# Altium project Mustafa_oguz_pcb.PrjPcb (part 3 of 3)

## Sheet Sensor Board.SchDoc
size 381 x 241 mm; SheetNumber: 5; SheetTotal: 5
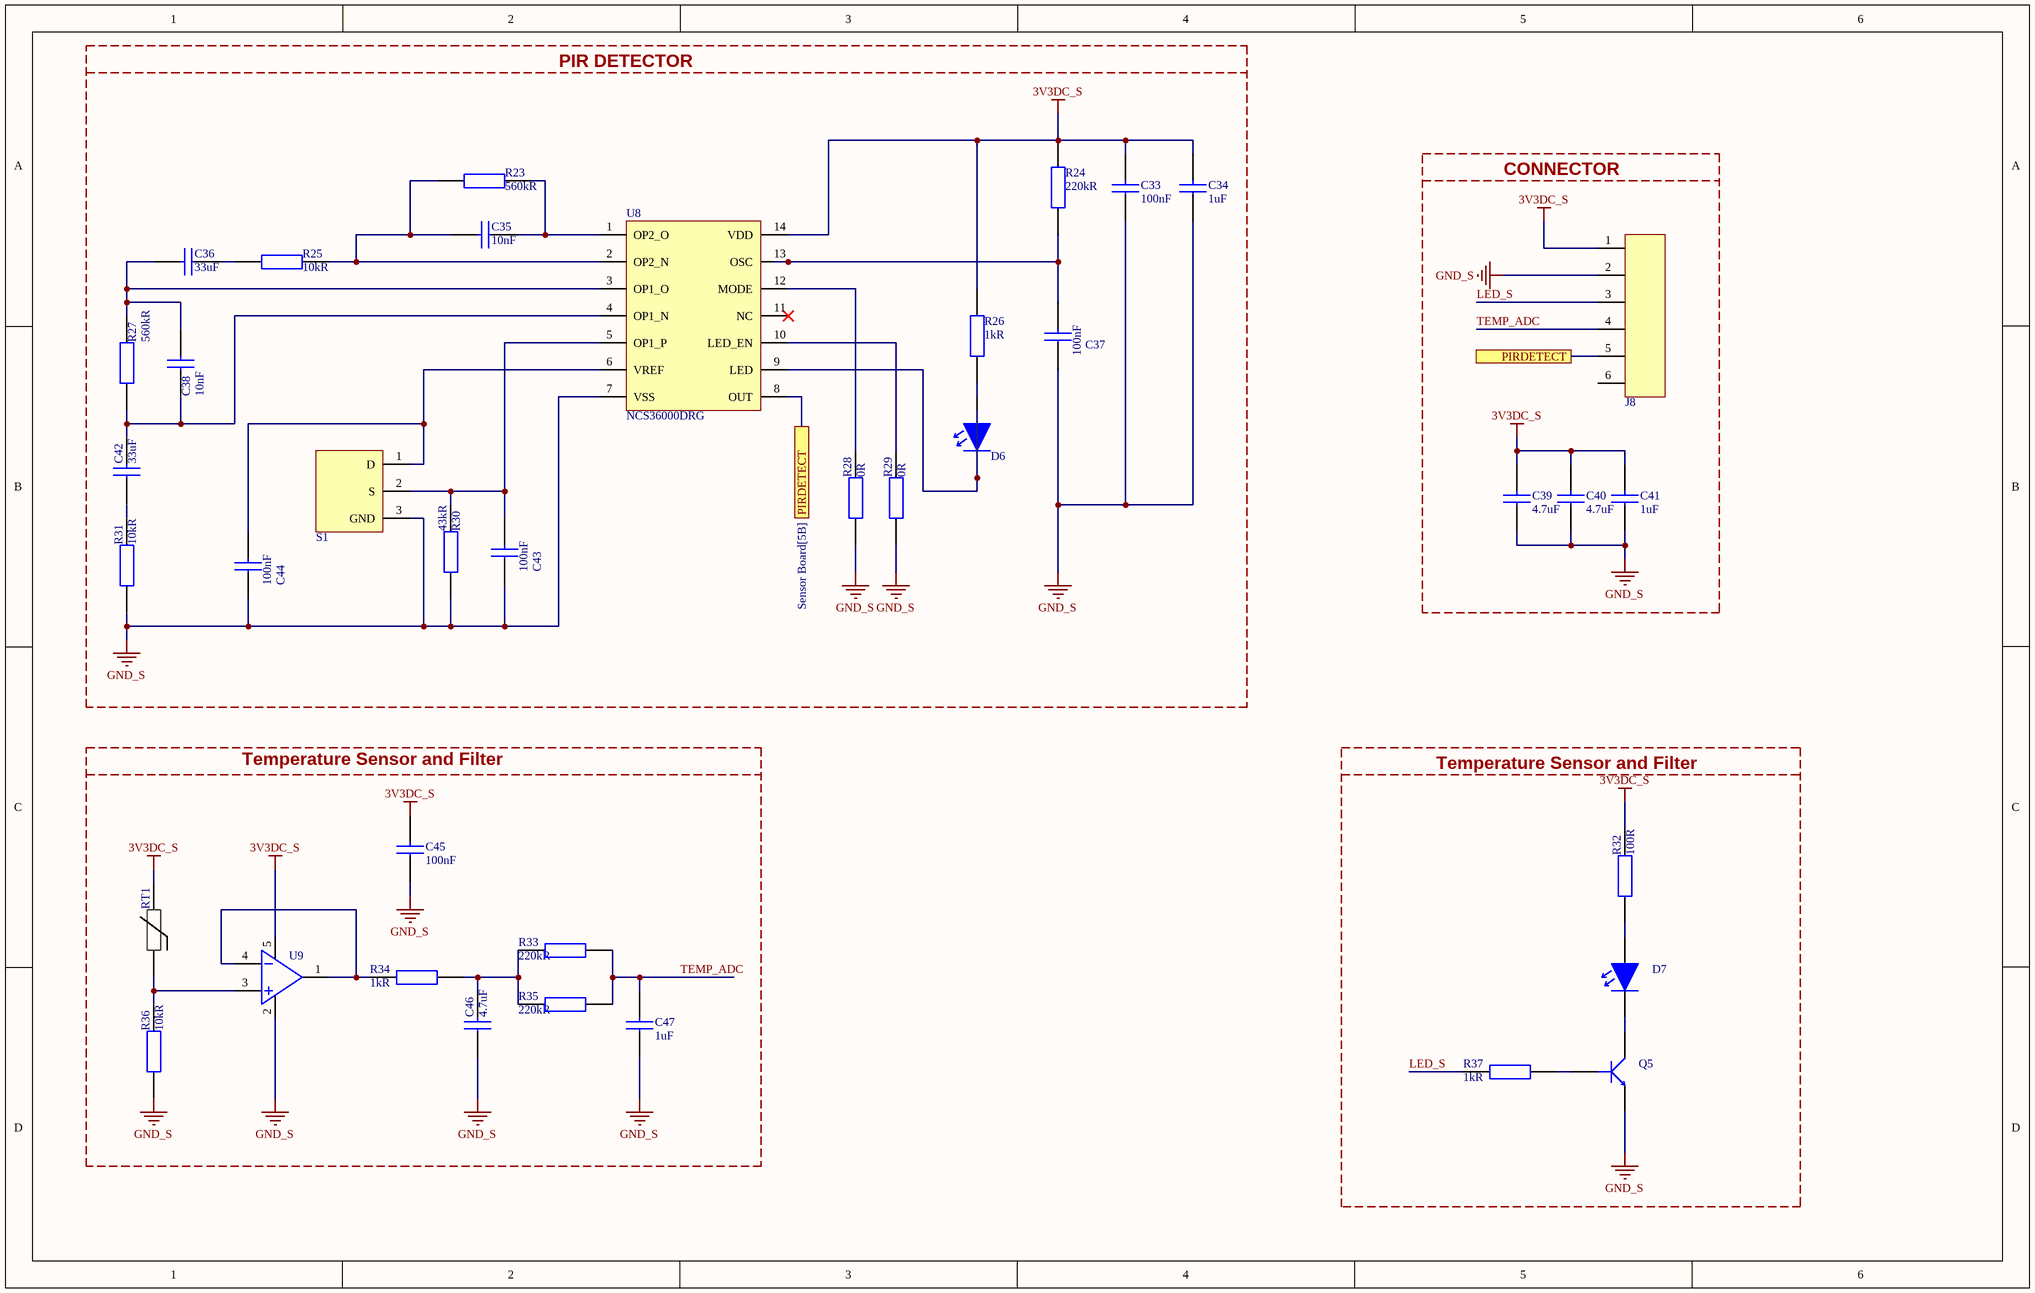
[diagram p4: Sensor Board.SchDoc]

### Parts
C33  Capacitance: 100nF  [CAP_0805]  (hidden comment: CL21B104KBCNNNC)
C34  Capacitance: 1uF  [CAP_0805]  (hidden comment: CL21B105KBFNNNE)
C35  Capacitance: 10nF  [CAP_0603]  (hidden comment: 0603B103K160CT)
C36  Capacitance: 33uF  [CAP_1206]  (hidden comment: C3216X5R1E336M160AC)
C37  C0603C104K5RAC7867  [CAP_0603]  (value not drawn)
C38  Capacitance: 10nF  [CAP_0603]  (hidden comment: 0603B103K160CT)
C39  Capacitance: 4.7uF  [CAP_0805]  (hidden comment: CL21A475KAQNNNE)
C40  Capacitance: 4.7uF  [CAP_0805]  (hidden comment: CL21A475KAQNNNE)
C41  Capacitance: 1uF  [CAP_0805]  (hidden comment: CL21B105KBFNNNE)
C42  Capacitance: 33uF  [CAP_1206]  (hidden comment: C3216X5R1E336M160AC)
C43  C0603C104K5RAC7867  [CAP_0603]  (value not drawn)
C44  C0603C104K5RAC7867  [CAP_0603]  (value not drawn)
C45  Capacitance: 100nF  [CAP_0805]  (hidden comment: CL21B104KBCNNNC)
C46  Capacitance: 4.7uF  [CAP_0805]  (hidden comment: CL21A475KAQNNNE)
C47  Capacitance: 1uF  [CAP_0805]  (hidden comment: CL21B105KBFNNNE)
D6  LTST-C171GKT  [LED_GREEN_0805]  (value not drawn)
D7  LH R974-LP-1  [LED_RED_0805]  (value not drawn)
J8  64800611622  [64800611622]  (value not drawn)
Q5  MMBT3904-7-F  [SOT-23F]  (value not drawn)
R23  Resistance: 560kR  [RES_0603]  (hidden comment: RC0603JR-07560KL)
R24  Resistance: 220kR  [RES_0603]  (hidden comment: RC0603JR-07220KL)
R25  value 10kR  [RES_0603]  (hidden comment: RC0603FR-0710KL)
R26  Resistance: 1kR  [RES_0603]  (hidden comment: RC0603FR-0710KL)
R27  Resistance: 560kR  [RES_0603]  (hidden comment: RC0603JR-07560KL)
R28  Resistance: 0R  [RES_0603]  (hidden comment: RC0603JR-070RL)
R29  Resistance: 0R  [RES_0603]  (hidden comment: RC0603JR-070RL)
R30  Resistance: 43kR  [RES_0603]  (hidden comment: RC0603JR-0743KL)
R31  value 10kR  [RES_0603]  (hidden comment: RC0603FR-0710KL)
R32  Resistance: 100R  [RES_0603]  (hidden comment: RC0603JR-07100RL)
R33  Resistance: 220kR  [RES_0603]  (hidden comment: RC0603JR-07220KL)
R34  Resistance: 1kR  [RES_0603]  (hidden comment: RC0603FR-0710KL)
R35  Resistance: 220kR  [RES_0603]  (hidden comment: RC0603JR-07220KL)
R36  value 10kR  [RES_0603]  (hidden comment: RC0603FR-0710KL)
R37  Resistance: 1kR  [RES_0603]  (hidden comment: RC0603FR-0710KL)
RT1  TFPT1206L1002FM  [RES_1206]  (value not drawn)
S1  LHI 878/3902  [LHI 878]  (value not drawn)
U8  NCS36000DRG  [SOIC14]
U9  OPA314AIDBVR  [SOT23-5]  (value not drawn)

### Blocks framed on the sheet
PIR DETECTOR: C33-C38 C42-C44 D6 R23-R31 S1 U8
CONNECTOR: C39-C41 J8
Temperature Sensor and Filter: C45-C47 R33-R36 RT1 U9
Temperature Sensor and Filter: D7 Q5 R32 R37

### Ports
PIRDETECT (see Sensor Board[3B]), PIRDETECT (see Sensor Board[5B])

### Nets
3V3DC_S: C33.2 C34.2 C39.2 C40.2 C41.2 C45.2 J8.1 R24.2 R26.2 R32.2 RT1.2 U8.14(VDD) U9.5
GND_S: C33.1 C34.1 C37.1 C39.1 C40.1 C41.1 C43.1 C44.1 C45.1 C46.1 C47.1 J8.2 Q5.2(E) R28.1 R29.1 R30.1 R31.2 R36.1 S1.3(GND) U8.7(VSS) U9.2
LED_S: J8.3 R37.1
TEMP_ADC: C47.2 J8.4 R33.2 R35.2
NetC35_1: C35.1 R23.2 U8.1(OP2_O)
NetC35_2: C35.2 R23.1 R25.2 U8.2(OP2_N)
NetC36_1: C36.1 R25.1
NetC36_2: C36.2 C38.2 R27.1 U8.3(OP1_O)
NetC37_2: C37.2 R24.1 U8.13(OSC)
NetC38_1: C38.1 C42.2 R27.2 U8.4(OP1_N)
NetC42_1: C42.1 R31.1
NetC43_2: C43.2 R30.2 S1.2(S) U8.5(OP1_P)
NetC44_2: C44.2 S1.1(D) U8.6(VREF)
NetC46_2: C46.2 R33.1 R34.2 R35.1
NetD6_1: D6.1 U8.9(LED)
NetD6_2: D6.2 R26.1
NetD7_1: D7.1 Q5.3(C)
NetD7_2: D7.2 R32.1
NetJ8_5: J8.5 U8.8(OUT) ; port PIRDETECT
NetQ5_1: Q5.1(B) R37.2
NetR28_2: R28.2 U8.12(MODE)
NetR29_2: R29.2 U8.10(LED_EN)
NetR34_1: R34.1 U9.1 U9.4
NetR36_2: R36.2 RT1.1 U9.3

Not connected (* = marked no-connect by the designer): J8 6; U8 11(NC)*

### Library data of the parts
C33 C45 = CAP CER 100nF 0805: CAP CER 100nF %10 0805; Manufacturer: Samsung; Designed by: Mustafa; Material: Ceramic; Tolerance: 10%; Dielectric: X7R; Voltage Rating: 50V; Supplier 1: Digi-Key; Manufacturer Part Number: CL21B104KBCNNNC; RoHS: Yes; Category: Ceramic Capacitors; Stock 1: 3371502; Pricing 1: 1=0,10000, 10=0,04700, 50=0,02560, 100=0,02090, 500=0,01494, 1000=0,01174 (USD); Mount: Surface Mount; Case/Package: 0805; Case Code (Metric): 2012; Case Code (Imperial): 0805; Contact Plating: Tin; Min Operating Temperature: -55°C; Max Operating Temperature: 125°C; Packaging: Tape and Reel; Voltage: 50V; Voltage Rating (DC): 50V; Series: CL; Construction: Flat; Length: 2mm; Width: 0.049inch; Height: 0.85mm; Depth: 1.25mm; Thickness: 0.037inch; Radiation Hardening: No; Lead Free: Lead Free; RoHS Compliant: Yes; ComponentLink1URL: https://datasheet.ciiva.com/25710/cl21b104kbcnnnc-25710182.pdf?src-supplier=Digi-Key; ComponentLink1Description: https://datasheet.ciiva.com/25710/cl21b104kbcnnnc-25710182.pdf?src-supplier=Digi-Key; ComponentLink2URL: https://datasheet.ciiva.com/29199/454152-da-01-en-vs-kondensator-0805-29199814.pdf?src-supplier=Conrad; ComponentLink2Description: https://datasheet.ciiva.com/29199/454152-da-01-en-vs-kondensator-0805-29199814.pdf?src-supplier=Conrad; Supplier Part Number 1: 1276-1003-1-ND
C34 C41 C47 = CAP CER 1uF 0805: CAP CER 1uF %10 0805; Manufacturer: Samsung; Designed by: Mustafa; Tolerance: 10%; Voltage Rating: 50V; Dielectric: X7R; Supplier 1: Digi-Key; Manufacturer Part Number: CL21B105KBFNNNE; RoHS: Yes; Category: Ceramic Capacitors; Stock 1: 958000; Pricing 1: 2000=0,02138, 4000=0,01956 (USD); Mount: Surface Mount; Case/Package: 0805; Case Code (Metric): 2012; Case Code (Imperial): 0805; Min Operating Temperature: -55°C; Max Operating Temperature: 125°C; Packaging: Tape and Reel; Package Quantity: 1; Voltage: 50V; Series: CL; Construction: Flat; Length: 2mm; Width: 0.049inch; Height: 1.25mm; Thickness: 0.053inch; Depth: 1.25mm; Radiation Hardening: No; RoHS Compliant: Yes; ComponentLink1URL: https://datasheet.ciiva.com/25800/cl21b105kbfnnne-25800291.pdf?src-supplier=Digi-Key; ComponentLink1Description: https://datasheet.ciiva.com/25800/cl21b105kbfnnne-25800291.pdf?src-supplier=Digi-Key; ComponentLink2URL: https://datasheet.ciiva.com/16449/cl21b105kbfnnne-16449003.pdf?src-supplier=Future+Electronics; ComponentLink2Description: https://datasheet.ciiva.com/16449/cl21b105kbfnnne-16449003.pdf?src-supplier=Future+Electronics; ComponentLink3URL: https://datasheet.ciiva.com/26838/getdatasheetpartid-354075-26838668.pdf?src-supplier=Verical; ComponentLink3Description: https://datasheet.ciiva.com/26838/getdatasheetpartid-354075-26838668.pdf?src-supplier=Verical; Supplier Part Number 1: 1276-1029-2-ND
C35 C38 = CAP CER 10nF 0603: CAP CER 10nF %10 0603; Manufacturer: Walsin Technologies; Designed by: Mustafa; Tolerance: 10%; Dielectric: X7R; Voltage Rating: 16V; Supplier 1: Digi-Key; Manufacturer Part Number: 0603B103K160CT; RoHS: Yes; Category: Ceramic Capacitors; Stock 1: 102474; Pricing 1: 1=0,10000, 10=0,03600, 50=0,01940, 100=0,01590, 500=0,01136, 1000=0,00892 (USD); Case/Package: 0603; Case Code (Metric): 1608; Case Code (Imperial): 0603; Min Operating Temperature: -55°C; Max Operating Temperature: 125°C; Packaging: Tape and Reel; Voltage Rating (DC): 16V; Length: 1.6mm; Depth: 0.8mm; REACH SVHC: Unknown; RoHS Compliant: Yes; ComponentLink1URL: http://www.farnell.com/datasheets/1958513.pdf?src-supplier=Farnell; ComponentLink1Description: http://www.farnell.com/datasheets/1958513.pdf?src-supplier=Farnell; ComponentLink2URL: http://components.arrow.com/part/dataview/0323_00656382?src-supplier=Arrow+Europe; ComponentLink2Description: http://components.arrow.com/part/dataview/0323_00656382?src-supplier=Arrow+Europe; ComponentLink3URL: http://www.farnell.com/datasheets/1958513.pdf?src-supplier=Element14; ComponentLink3Description: http://www.farnell.com/datasheets/1958513.pdf?src-supplier=Element14; ComponentLink4URL: http://www.passivecomponent.com/wp-content/uploads/2018/10/MLCC.pdf?src-supplier=Digi-Key; ComponentLink4Description: http://www.passivecomponent.com/wp-content/uploads/2018/10/MLCC.pdf?src-supplier=Digi-Key; Supplier Part Number 1: 1292-1384-1-ND
C36 C42 = CAP CER 33uF 1206: CAP CER 33uF %20 1206 SMD; Manufacturer: TDK; Dielectric Material: Ceramic; Voltage Rating: 25V; Tolerance: 20%; Dielectric: X5R; Designed by: Mustafa; Supplier 1: Digi-Key; Manufacturer Part Number: C3216X5R1E336M160AC; RoHS: Yes; Category: Ceramic Capacitors; Stock 1: 149381; Pricing 1: 1=1,04000, 10=0,82500, 50=0,71500, 100=0,61880, 500=0,46750, 1000=0,41250 (USD); Mount: Surface Mount; Case/Package: 1206; Case Code (Metric): 3216; Case Code (Imperial): 1206; Weight: 0.000571oz; Min Operating Temperature: -55°C; Max Operating Temperature: 85°C; Packaging: Tape and Reel; Termination: SMD/SMT; Package Quantity: 1; Voltage Rating (DC): 25V; Resistor Type: Ceramic; Series: C; Length: 3.2mm; Width: 0.063inch; Depth: 1.6mm; Thickness: 1.6mm; REACH SVHC: No SVHC; Lead Free: Lead Free; RoHS Compliant: Yes; ComponentLink1URL: https://datasheet.ciiva.com/24216/c3216x5r1e336m160ac-265051-24216512.pdf?src-supplier=Mouser; ComponentLink1Description: https://datasheet.ciiva.com/24216/c3216x5r1e336m160ac-265051-24216512.pdf?src-supplier=Mouser; ComponentLink2URL: https://datasheet.ciiva.com/6285/tdkmlcccaprange-6285278.pdf?src-supplier=Digi-Key; ComponentLink2Description: https://datasheet.ciiva.com/6285/tdkmlcccaprange-6285278.pdf?src-supplier=Digi-Key; Supplier Part Number 1: 445-8046-1-ND
C37 C43 C44 = CAP CER 100nF 0603: CAP CER 100nF %10 0603 SMD; Manufacturer: KEMET; Manufacturer Part Number: C0603C104K5RACTU; Material: 4241ConductorMaterial; Tolerance: 10%; Dielectric: X7R; Voltage Rating: 50V; Temperature Coefficient: 30ppm/°C; Designed by: Mustafa; Supplier: Digi-Key; Supplier Part Number: 399-C0603C104K5RAC7867CT-ND; RoHS: Yes; Category: Ceramic Capacitors; Stock: 5465375; Pricing: 1=0,11, 10=0,074, 50=0,0424, 100=0,0329, 500=0,02474, 1000=0,01944 (USD); Mounting Technology: Surface Mount; Case/Package: 0603; Min Operating Temperature: -55°C; Max Operating Temperature: 125°C; Value: 100nF; Packaging: Tape and Reel; Voltage: 50V; Series: SMD Comm X7R; Length: 0.063inch; Width: 0.031inch; Thickness: 0.034inch; RoHS Compliant: Yes; Lead Free: 5697LeadFree
C39 C40 C46 = CAP CER 4.7uF 0805: CAP CER 4.7uF %10 0805; Manufacturer: Samsung; Tolerance: 10%; Voltage Rating: 25V; Dielectric: X5R; Designed by: Mustafa; Supplier 1: Digi-Key; Manufacturer Part Number: CL21A475KAQNNNE; RoHS: Yes; Category: Ceramic Capacitors; Stock 1: 1477018; Pricing 1: 1=0,11000, 10=0,08100, 50=0,04580, 100=0,03800, 500=0,02664, 1000=0,02205 (USD); Mount: Surface Mount; Case/Package: 0805; Case Code (Metric): 2012; Case Code (Imperial): 0805; Min Operating Temperature: -55°C; Max Operating Temperature: 85°C; Package Quantity: 1; Packaging: Tape and Reel; Voltage Rating (DC): 25V; Series: CL; Construction: Flat; Length: 2mm; Width: 0.049inch; Height: 1.25mm; Thickness: 0.055inch; Depth: 1.25mm; Radiation Hardening: No; Lead Free: Lead Free; RoHS Compliant: Yes; ComponentLink1URL: https://datasheet.ciiva.com/25798/cl21a475kaqnnne-25798882.pdf?src-supplier=Digi-Key; ComponentLink1Description: https://datasheet.ciiva.com/25798/cl21a475kaqnnne-25798882.pdf?src-supplier=Digi-Key; Supplier Part Number 1: 1276-1244-1-ND
D6 = LED GREEN 0805: Green 0805 130 º Min 5 mcd Typical 12 mcd Water Clear Lens SMT LED; Manufacturer: Vishay Lite-On; Designed by: Mustafa; Lens Color: Colorless; Viewing Angle: 130°; Lens Style: Diffused,Colorless,Rectangular,Clear; Luminous Intensity: 12mcd; Forward Current: 30mA; Forward Voltage: 2.1V; Power Rating: 100mW; Dominant Wavelength: 569nm; Test Current: 10mA; Number of Elements: 1; Wavelength: 585nm; Reverse Voltage: 5V; Supplier 1: Digi-Key; Manufacturer Part Number: LTST-C171GKT; RoHS: Yes; Category: LEDs; Stock 1: 159023; Pricing 1: 1=0,26000, 10=0,14100, 100=0,06560, 500=0,06060, 1000=0,04747 (USD); Mount: Surface Mount; Case/Package: 0805; Number of Pins: 2; Color: Green; Case Code (Metric): 2012; Case Code (Imperial): 0805; Min Operating Temperature: -55°C; Max Operating Temperature: 85°C; Package Quantity: 1; Packaging: Tape and Reel; Illumination Color: Green; Lens Transparency: Clear; Power Dissipation: 100mW; Number of LEDs: 1; Series: CHIPLED 0805; Length: 2mm; Width: 1.25mm; Height: 0.8mm; Depth: 1.25mm; Radiation Hardening: No; Lead Free: Lead Free; RoHS Compliant: Yes; ComponentLink1URL: https://datasheet.ciiva.com/2110/ltst-c171gkt-2110000.pdf?src-supplier=Digi-Key; ComponentLink1Description: https://datasheet.ciiva.com/2110/ltst-c171gkt-2110000.pdf?src-supplier=Digi-Key; ComponentLink2URL: https://datasheet.ciiva.com/11773/0900766b80dc0296-11773991.pdf?src-supplier=RSComponents; ComponentLink2Description: https://datasheet.ciiva.com/11773/0900766b80dc0296-11773991.pdf?src-supplier=RSComponents; ComponentLink3URL: https://datasheet.ciiva.com/12400/lite-on-ltst-c171gkt-190133-12400647.pdf?src-supplier=Mouser; ComponentLink3Description: https://datasheet.ciiva.com/12400/lite-on-ltst-c171gkt-190133-12400647.pdf?src-supplier=Mouser; ComponentLink4URL: https://datasheet.ciiva.com/2110/ltst-c171gkt-2110001.pdf?src-supplier=Digi-Key; ComponentLink4Description: https://datasheet.ciiva.com/2110/ltst-c171gkt-2110001.pdf?src-supplier=Digi-Key; ComponentLink5URL: https://datasheet.ciiva.com/2110/ltst-c171gkt-2110002.pdf?src-supplier=Digi-Key; ComponentLink5Description: https://datasheet.ciiva.com/2110/ltst-c171gkt-2110002.pdf?src-supplier=Digi-Key; ComponentLink6URL: https://datasheet.ciiva.com/16396/ltst-c171gkt-16396549.pdf?src-supplier=Future+Electronics; ComponentLink6Description: https://datasheet.ciiva.com/16396/ltst-c171gkt-16396549.pdf?src-supplier=Future+Electronics; Supplier Part Number 1: 160-1423-1-ND
D7 = LED RED 0805: LED Uni-Color Hyper Red 660nm 2-Pin Chip 0805(2012Metric) T/R; Manufacturer: Osram Opto; Lens Color: White; Forward Voltage: 1.8V; Lens Style: Diffused,Flat,Colorless; Luminous Intensity: 71mcd; Viewing Angle: 160°; Forward Current: 30mA; Dominant Wavelength: 645nm; Number of Elements: 1; Test Current: 20mA; Reverse Voltage: 5V; Lens Transparency: Diffused; Luminous Flux: 0.17lm; Lens Size: 1.25mm; Designed by: Mustafa; Supplier 1: Digi-Key; Manufacturer Part Number: LH R974-LP-1; RoHS: Yes; Category: LEDs; Stock 1: 35632; Pricing 1: 1=0,26000, 10=0,13900, 100=0,06480, 500=0,05978, 1000=0,04683, 2000=0,04584 (USD); Mount: Surface Mount; Case/Package: 0805; Number of Pins: 2; Color: Red; Case Code (Imperial): 0805; Case Code (Metric): 2012; Min Operating Temperature: -30°C; Max Operating Temperature: 85°C; Packaging: Tape and Reel; Illumination Color: Red; Package Quantity: 1; Series: CHipLED; Length: 2.1mm; Width: 1.25mm; Depth: 1.35mm; Radiation Hardening: No; RoHS Compliant: Yes; ComponentLink1URL: http://www.jameco.com/Jameco/Products/ProdDS/2085634.pdf?src-supplier=Jameco; ComponentLink1Description: http://www.jameco.com/Jameco/Products/ProdDS/2085634.pdf?src-supplier=Jameco; ComponentLink2URL: http://components.arrow.com/part/dataview/0323_01825492?src-supplier=Arrow+Europe; ComponentLink2Description: http://components.arrow.com/part/dataview/0323_01825492?src-supplier=Arrow+Europe; ComponentLink3URL: https://dammedia.osram.info/media/resource/hires/osram-dam-2493888/LH%20R974.pdf?src-supplier=Digi-Key; ComponentLink3Description: https://dammedia.osram.info/media/resource/hires/osram-dam-2493888/LH%20R974.pdf?src-supplier=Digi-Key; ComponentLink4URL: http://www.mouser.com/ds/2/311/LH%20R974%20-%20CHIPLED%200805-318659.pdf?src-supplier=Mouser; ComponentLink4Description: http://www.mouser.com/ds/2/311/LH%20R974%20-%20CHIPLED%200805-318659.pdf?src-supplier=Mouser; ComponentLink5URL: https://www.verical.com/server-webapp/html/getDatasheet?partID=258950&src-supplier=Verical; ComponentLink5Description: https://www.verical.com/server-webapp/html/getDatasheet?partID=258950&src-supplier=Verical; ComponentLink6URL: http://components.arrow.com/part/dataview/41971690S1077610N9133?src-supplier=Arrow+Electronics; ComponentLink6Description: http://components.arrow.com/part/dataview/41971690S1077610N9133?src-supplier=Arrow+Electronics; ComponentLink7URL: http://components.arrow.com/part/dataview/41971690S6190115N2128?src-supplier=Arrow+Electronics; ComponentLink7Description: http://components.arrow.com/part/dataview/41971690S6190115N2128?src-supplier=Arrow+Electronics; Supplier Part Number 1: 475-1415-1-ND
J8 = 64800611622_conn_6pin: 1.50mm 6PIN Connector; Manufacturer: Wurth Electronics; Supplier 1: RSComponents; Manufacturer Part Number: 64800611622; RoHS: No; Stock 1: 100; Pricing 1: 1000=0,29900, 2000=0,28200 (GBP); Supplier Part Number 1: 2138726
Q5 = MMBT3904-7-F: Transistor General Purpose BJT NPN 40 Volt 0.2A Automotive 3-Pin SOT-23; Manufacturer: Diodes Zetex; Designed by: BERK; Max Power Dissipation: 300mW; Collector Emitter Voltage (VCEO): 40V; Max Collector Current: 200mA; Collector Base Voltage (VCBO): 60V; Frequency: 300MHz; hFE Min: 100; Number of Elements: 1; Emitter Base Voltage (VEBO): 6V; Collector Emitter Saturation Voltage: 300mV; Power Dissipation: 350mW; Element Configuration: Single; Supplier 1: Digi-Key; Manufacturer Part Number: MMBT3904-7-F; RoHS: Yes; Category: BJTs; Stock 1: 2393281; Pricing 1: 1=0,12000, 10=0,08600, 25=0,08280, 100=0,04660, 500=0,03664, 1000=0,02544 (USD); Mount: Surface Mount; Case/Package: SOT-23; Number of Pins: 3; Weight: 0.000282oz; Contact Plating: Tin,Matte; Min Operating Temperature: -55°C; Max Operating Temperature: 150°C; Polarity: NPN; Packaging: Tape and Reel; Package Quantity: 3000; Transition Frequency: 300MHz; Collector Emitter Breakdown Voltage: 40V; Max Breakdown Voltage: 40V; Continuous Collector Current: 200mA; Max Frequency: 300MHz; Gain Bandwidth Product: 300MHz; Series: -; Collector-emitter Voltage-Max: 300mV; Voltage Rating (DC): 40V; Length: 3.05mm; Width: 1.4mm; Height: 1mm; Radiation Hardening: No; REACH SVHC: No SVHC; Lead Free: Lead Free; RoHS Compliant: Yes; ComponentLink1URL: https://datasheet.ciiva.com/11201/ds30036-11201778.pdf?src-supplier=Avnet; ComponentLink1Description: https://datasheet.ciiva.com/11201/ds30036-11201778.pdf?src-supplier=Avnet; ComponentLink2URL: https://datasheet.ciiva.com/15138/getdatasheetpartid-53265-15138780.pdf?src-supplier=Verical; ComponentLink2Description: https://datasheet.ciiva.com/15138/getdatasheetpartid-53265-15138780.pdf?src-supplier=Verical; ComponentLink3URL: https://datasheet.ciiva.com/6361/ds30036-6361254.pdf?src-supplier=Digi-Key; ComponentLink3Description: https://datasheet.ciiva.com/6361/ds30036-6361254.pdf?src-supplier=Digi-Key; ComponentLink4URL: https://datasheet.ciiva.com/22711/1915516-22711750.pdf?src-supplier=Element14; ComponentLink4Description: https://datasheet.ciiva.com/22711/1915516-22711750.pdf?src-supplier=Element14; ComponentLink5URL: https://datasheet.ciiva.com/11198/ds30036-11198999.pdf?src-supplier=Avnet; ComponentLink5Description: https://datasheet.ciiva.com/11198/ds30036-11198999.pdf?src-supplier=Avnet; ComponentLink6URL: https://datasheet.ciiva.com/6361/ds30036-6361256.pdf?src-supplier=Digi-Key; ComponentLink6Description: https://datasheet.ciiva.com/6361/ds30036-6361256.pdf?src-supplier=Digi-Key; Supplier Part Number 1: MMBT3904-FDIDKR-ND
R23 R27 = RES 560K OHM 0603: RES SMD 560K OHM 5% 1/10W 0603; Manufacturer: Yageo; Designed by: BERK; Power Rating: 100mW; Voltage Rating: 75V; Voltage Rating (DC): 50V; Temperature Coefficient: 100ppm/°C; Supplier 1: Digi-Key; Manufacturer Part Number: RC0603JR-07560KL; RoHS: Yes; Category: Chip SMD Resistors; Stock 1: 686040; Pricing 1: 1=0,10000, 10=0,01900, 100=0,00770, 1000=0,00344, 2500=0,00298 (USD); Case/Package: 0603; Number of Pins: 2; Case Code (Metric): 1608; Case Code (Imperial): 0603; Weight: 7.1E-05oz; Min Operating Temperature: -55°C; Max Operating Temperature: 155°C; Package Quantity: 1; Tolerance: 5%; Packaging: Tape and Reel; Resistor Type: Thick Film; Number of Terminations: 2; Termination: SMD/SMT; Max Power Dissipation: 100mW; Working Voltage: 75V; Features: Moisture Resistant; Series: RC; Resistance Tolerance: 5%; Construction: Rectangular; Technology: THICK FILM; Length: 1.6mm; Width: 0.8mm; Height: 0.022inch; Depth: 0.8mm; REACH SVHC: Unknown; Military Standard: Not; Lead Free: Lead Free; RoHS Compliant: Yes; ComponentLink1URL: https://datasheet.ciiva.com/2453/pyu-r-int-thick-7-2453056.pdf?src-supplier=Digi-Key; ComponentLink1Description: https://datasheet.ciiva.com/2453/pyu-r-int-thick-7-2453056.pdf?src-supplier=Digi-Key; ComponentLink2URL: https://datasheet.ciiva.com/2453/pyu-r-int-thick-7-2453057.pdf?src-supplier=Digi-Key; ComponentLink2Description: https://datasheet.ciiva.com/2453/pyu-r-int-thick-7-2453057.pdf?src-supplier=Digi-Key; ComponentLink3URL: https://datasheet.ciiva.com/2453/pyu-r-int-thick-7-2453055.pdf?src-supplier=Digi-Key; ComponentLink3Description: https://datasheet.ciiva.com/2453/pyu-r-int-thick-7-2453055.pdf?src-supplier=Digi-Key; Supplier Part Number 1: 311-560KGRCT-ND
R24 R33 R35 = RES 220K OHM 0603: RES 220K %5 OHM 0603 SMD; Manufacturer: Yageo; Deisgned by: BERK; Tolerance: 5%; Temperature Coefficient: 100ppm/°C; Voltage Rating (DC): 50V; Power Rating: 100mW; Supplier 1: Digi-Key; Manufacturer Part Number: RC0603JR-07220KL; RoHS: Yes; Category: Chip SMD Resistors; Stock 1: 558053; Pricing 1: 1=0,10000, 10=0,01900, 100=0,00770, 1000=0,00344, 2500=0,00298 (USD); Case/Package: 0603; Number of Pins: 2; Case Code (Imperial): 0603; Case Code (Metric): 1608; Size Code: 0603; Min Operating Temperature: -55°C; Max Operating Temperature: 155°C; Resistor Type: Thick Film; Packaging: Tape and Reel; Voltage Rating: 50V; Package Quantity: 1; Termination: SMD/SMT; Number of Terminations: 2; Max Power Dissipation: 100mW; Features: Moisture Resistant; Series: RC; Construction: Rectangular; Resistance Tolerance: 5%; Length: 1.6mm; Width: 0.031inch; Height: 0.022inch; Depth: 0.8mm; REACH SVHC: No SVHC; Lead Free: Lead Free; RoHS Compliant: Yes; Military Standard: Not; ComponentLink1URL: https://datasheet.ciiva.com/2452/pyu-r-int-thick-7-2452923.pdf?src-supplier=Digi-Key; ComponentLink1Description: https://datasheet.ciiva.com/2452/pyu-r-int-thick-7-2452923.pdf?src-supplier=Digi-Key; ComponentLink2URL: https://datasheet.ciiva.com/2452/pyu-r-int-thick-7-2452924.pdf?src-supplier=Digi-Key; ComponentLink2Description: https://datasheet.ciiva.com/2452/pyu-r-int-thick-7-2452924.pdf?src-supplier=Digi-Key; ComponentLink3URL: https://datasheet.ciiva.com/2452/pyu-r-int-thick-7-2452925.pdf?src-supplier=Digi-Key; ComponentLink3Description: https://datasheet.ciiva.com/2452/pyu-r-int-thick-7-2452925.pdf?src-supplier=Digi-Key; Supplier Part Number 1: 311-220KGRCT-ND
R25 R31 R36 = RES 10K OHM 0603: RES 10K %1 OHM 0603 SMD; Manufacturer: Yageo; Designed by: Mustafa; Voltage Rating (DC): 50V; Tolerance: 1%; Temperature Coefficient: 100ppm/°C; Power Rating: 100mW; Voltage Rating: 75V; Supplier: Digi-Key; Supplier Part Number: 311-10.0KHRCT-ND; Manufacturer Part Number: RC0603FR-0710KL; RoHS: Yes; Category: Chip SMD Resistors; Stock: 24703208; Pricing: 1=0,1, 10=0,019, 50=0,0112, 100=0,0093, 500=0,00622, 1000=0,00532 (USD); Case/Package: 0603; Pins: 2; Case Code (Imperial): 0603; Case Code (Metric): 1608; Weight: 7.1E-05oz; Min Operating Temperature: -55°C; Max Operating Temperature: 155°C; Packaging: Tape and Reel; Resistor Type: Thick Film; Termination: SMD/SMT; Features: Moisture Resistant; Series: RC; Max Power Dissipation: 100mW; Number of Terminations: 2; Resistance Tolerance: 1%; Construction: Rectangular; Length: 1.6mm; Width: 0.8mm; Height: 0.45mm; Depth: 0.8mm; Lead Pitch: 0.3mm; Reach SVHC Compliant: No; Lead Free: 5697LeadFree; Military Standard: Not; RoHS Compliant: Yes; ComponentLink1URL: https://datasheet.ciiva.com/7660/38590-7660789.pdf?src-supplier=Element14; ComponentLink1Description: https://datasheet.ciiva.com/7660/38590-7660789.pdf?src-supplier=Element14; ComponentLink2URL: https://datasheet.ciiva.com/7983/443971-7983596.pdf?src-supplier=Element14; ComponentLink2Description: https://datasheet.ciiva.com/7983/443971-7983596.pdf?src-supplier=Element14; ComponentLink3URL: https://datasheet.ciiva.com/22747/443971-22747519.pdf?src-supplier=Element14; ComponentLink3Description: https://datasheet.ciiva.com/22747/443971-22747519.pdf?src-supplier=Element14; ComponentLink4URL: https://datasheet.ciiva.com/46440/1868787-46440891.pdf?src-supplier=Element14; ComponentLink4Description: https://datasheet.ciiva.com/46440/1868787-46440891.pdf?src-supplier=Element14; ComponentLink5URL: https://datasheet.ciiva.com/7746/1738695-7746239.pdf?src-supplier=Element14; ComponentLink5Description: https://datasheet.ciiva.com/7746/1738695-7746239.pdf?src-supplier=Element14; ComponentLink6URL: https://datasheet.ciiva.com/15189/getdatasheetpartid-409289-15189591.pdf?src-supplier=Verical; ComponentLink6Description: https://datasheet.ciiva.com/15189/getdatasheetpartid-409289-15189591.pdf?src-supplier=Verical
R26 R34 R37 = RES 1K OHM 0603: RES 1K %1 OHM 0603 SMD; Manufacturer: Yageo; Manufacturer Part Number: RC0603JR-071KL; Designed by: BERK; Tolerance: 5%; Temperature Coefficient: 100ppm/°C; Voltage Rating (DC): 50V; Power Rating: 100mW; Body Length: 1.6mm; Supplier 1: Digi-Key; RoHS: Yes; Category: Chip SMD Resistors; Stock 1: 5112056; Pricing 1: 1=0,10000, 10=0,01900, 100=0,00770, 1000=0,00344, 2500=0,00298 (USD); Case/Package: 0603; Number of Pins: 2; Contact Plating: Tin,Matte; Case Code (Imperial): 0603; Case Code (Metric): 1608; Size Code: 0603; Min Operating Temperature: -55°C; Max Operating Temperature: 155°C; Resistor Type: Thick Film; Packaging: Tape and Reel; Package Quantity: 5000; Voltage Rating: 50V; Termination: SMD/SMT; Series: RC; Resistance Tolerance: 5%; Construction: Rectangular; Length: 1.6mm; Width: 0.8mm; Height: 0.45mm; Depth: 0.8mm; Radiation Hardening: No; REACH SVHC: Unknown; Lead Free: Lead Free; Military Standard: Not; RoHS Compliant: Yes; ComponentLink1URL: https://datasheet.ciiva.com/8883/pyu-rc0603-51-rohs-l-4-8883051.pdf?src-supplier=Avnet; ComponentLink1Description: https://datasheet.ciiva.com/8883/pyu-rc0603-51-rohs-l-4-8883051.pdf?src-supplier=Avnet; ComponentLink2URL: https://datasheet.ciiva.com/7746/443971-7746461.pdf?src-supplier=Element14; ComponentLink2Description: https://datasheet.ciiva.com/7746/443971-7746461.pdf?src-supplier=Element14; ComponentLink3URL: https://datasheet.ciiva.com/22747/443971-22747533.pdf?src-supplier=Element14; ComponentLink3Description: https://datasheet.ciiva.com/22747/443971-22747533.pdf?src-supplier=Element14; ComponentLink4URL: https://datasheet.ciiva.com/7746/443971-7746462.pdf?src-supplier=Element14; ComponentLink4Description: https://datasheet.ciiva.com/7746/443971-7746462.pdf?src-supplier=Element14; Supplier Part Number 1: 311-1.0KGRCT-ND
R28 R29 = RES 0 OHM 0603: RES 0 %1 OHM 0603 SMD; Manufacturer: Yageo; Tolerance: 1%; Power Rating: 100mW; Voltage Rating (DC): 50V; Temperature Coefficient: 200ppm/°C; Resistance Tolerance: 5%; Designed by: BERK; Supplier 1: Digi-Key; Manufacturer Part Number: RC0603JR-070RL; RoHS: Yes; Category: Chip SMD Resistors; Stock 1: 4657486; Pricing 1: 1=0,10000, 10=0,01700, 25=0,01240, 50=0,00940, 100=0,00700, 250=0,00532, 500=0,00424, 1000=0,00313 (USD); Case/Package: 0603; Number of Pins: 2; Contact Plating: Tin,Matte; Case Code (Imperial): 0603; Case Code (Metric): 1608; Size Code: 0603; Min Operating Temperature: -55°C; Max Operating Temperature: 155°C; Resistor Type: Thick Film; Packaging: Tape and Reel; Termination: SMD/SMT; Series: RC; Technology: THICK FILM; Package Quantity: 5000; Voltage Rating: 50V; Features: Moisture Resistant; Max Power Dissipation: 100mW; Number of Terminations: 2; Construction: Rectangular; Length: 1.6mm; Width: 0.8mm; Height: 0.45mm; Depth: 0.8mm; Radiation Hardening: No; REACH SVHC: No SVHC; Lead Free: Lead Free; RoHS Compliant: Yes; Military Standard: Not; ComponentLink1URL: https://datasheet.ciiva.com/11808/pyu-r-int-6-11808700.pdf?src-supplier=RSComponents; ComponentLink1Description: https://datasheet.ciiva.com/11808/pyu-r-int-6-11808700.pdf?src-supplier=RSComponents; ComponentLink2URL: https://datasheet.ciiva.com/7746/1738695-7746421.pdf?src-supplier=Element14; ComponentLink2Description: https://datasheet.ciiva.com/7746/1738695-7746421.pdf?src-supplier=Element14; ComponentLink3URL: https://datasheet.ciiva.com/8883/pyu-rc0603-51-rohs-l-4-8883045.pdf?src-supplier=Avnet; ComponentLink3Description: https://datasheet.ciiva.com/8883/pyu-rc0603-51-rohs-l-4-8883045.pdf?src-supplier=Avnet; ComponentLink4URL: https://datasheet.ciiva.com/15189/getdatasheetpartid-329462-15189845.pdf?src-supplier=Verical; ComponentLink4Description: https://datasheet.ciiva.com/15189/getdatasheetpartid-329462-15189845.pdf?src-supplier=Verical; ComponentLink5URL: https://datasheet.ciiva.com/7746/1738695-7746422.pdf?src-supplier=Element14; ComponentLink5Description: https://datasheet.ciiva.com/7746/1738695-7746422.pdf?src-supplier=Element14; ComponentLink6URL: https://datasheet.ciiva.com/12555/rc0603-272842-12555254.pdf?src-supplier=Mouser; ComponentLink6Description: https://datasheet.ciiva.com/12555/rc0603-272842-12555254.pdf?src-supplier=Mouser; ComponentLink7URL: https://datasheet.ciiva.com/22747/443971-22747530.pdf?src-supplier=Element14; ComponentLink7Description: https://datasheet.ciiva.com/22747/443971-22747530.pdf?src-supplier=Element14; Supplier Part Number 1: 311-0.0GRCT-ND
R30 = RES 43K OHM 0603: RES 43K %5 OHM 0603 SMD; Manufacturer: Yageo; Designed by: BERK; Voltage Rating: 75V; Power Rating: 100mW; Tolerance: 5%; Temperature Coefficient: 100ppm/°C; Voltage Rating (DC): 50V; Supplier 1: Digi-Key; Manufacturer Part Number: RC0603JR-0743KL; RoHS: Yes; Category: Chip SMD Resistors; Stock 1: 127716; Pricing 1: 1=0,10000, 10=0,01900, 100=0,00770, 1000=0,00344, 2500=0,00298 (USD); Case/Package: 0603; Case Code (Imperial): 0603; Case Code (Metric): 1608; Weight: 7.1E-05oz; Min Operating Temperature: -55°C; Max Operating Temperature: 155°C; Packaging: Tape and Reel; Package Quantity: 1; Termination: SMD/SMT; Resistor Type: Thick Film; Number of Terminations: 2; Max Power Dissipation: 100mW; Working Voltage: 75V; Features: Moisture Resistant; Series: RC; Construction: Rectangular; Technology: THICK FILM; Length: 1.6mm; Width: 0.8mm; Height: 0.022inch; Depth: 0.8mm; Military Standard: Not; Lead Free: Lead Free; RoHS Compliant: Yes; ComponentLink1URL: https://datasheet.ciiva.com/2453/pyu-r-int-thick-7-2453052.pdf?src-supplier=Digi-Key; ComponentLink1Description: https://datasheet.ciiva.com/2453/pyu-r-int-thick-7-2453052.pdf?src-supplier=Digi-Key; ComponentLink2URL: https://datasheet.ciiva.com/2453/pyu-r-int-thick-7-2453053.pdf?src-supplier=Digi-Key; ComponentLink2Description: https://datasheet.ciiva.com/2453/pyu-r-int-thick-7-2453053.pdf?src-supplier=Digi-Key; ComponentLink3URL: https://datasheet.ciiva.com/2453/pyu-r-int-thick-7-2453054.pdf?src-supplier=Digi-Key; ComponentLink3Description: https://datasheet.ciiva.com/2453/pyu-r-int-thick-7-2453054.pdf?src-supplier=Digi-Key; Supplier Part Number 1: 311-43KGRCT-ND
R32 = RES 100 OHM 0603: RES 100 %5 OHM 0603 SMD; Manufacturer: Yageo; Designed by: BERK; Tolerance: 5%; Temperature Coefficient: 100ppm/°C; Voltage Rating (DC): 50V; Power Rating: 100mW; Supplier 1: Digi-Key; Manufacturer Part Number: RC0603JR-07100RL; RoHS: Yes; Category: Chip SMD Resistors; Stock 1: 4334796; Pricing 1: 1=0,10000, 10=0,01900, 100=0,00770, 1000=0,00344, 2500=0,00298 (USD); Case/Package: 0603; Number of Pins: 2; Contact Plating: Tin,Matte; Case Code (Imperial): 0603; Case Code (Metric): 1608; Size Code: 0603; Min Operating Temperature: -55°C; Max Operating Temperature: 155°C; Resistor Type: Thick Film; Packaging: Tape and Reel; Voltage Rating: 50V; Termination: SMD/SMT; Features: Moisture Resistant; Series: RC; Max Power Dissipation: 100mW; Number of Terminations: 2; Construction: Rectangular; Resistance Tolerance: 5%; Length: 1.6mm; Width: 0.8mm; Depth: 0.8mm; Radiation Hardening: No; REACH SVHC: Unknown; Lead Free: Lead Free; Military Standard: Not; RoHS Compliant: Yes; ComponentLink1URL: https://datasheet.ciiva.com/15189/getdatasheetpartid-325207-15189846.pdf?src-supplier=Verical; ComponentLink1Description: https://datasheet.ciiva.com/15189/getdatasheetpartid-325207-15189846.pdf?src-supplier=Verical; ComponentLink2URL: https://datasheet.ciiva.com/8883/pyu-rc0603-51-rohs-l-4-8883047.pdf?src-supplier=Avnet; ComponentLink2Description: https://datasheet.ciiva.com/8883/pyu-rc0603-51-rohs-l-4-8883047.pdf?src-supplier=Avnet; ComponentLink3URL: https://datasheet.ciiva.com/7746/443971-7746425.pdf?src-supplier=Element14; ComponentLink3Description: https://datasheet.ciiva.com/7746/443971-7746425.pdf?src-supplier=Element14; ComponentLink4URL: https://datasheet.ciiva.com/7746/443971-7746426.pdf?src-supplier=Element14; ComponentLink4Description: https://datasheet.ciiva.com/7746/443971-7746426.pdf?src-supplier=Element14; Supplier Part Number 1: 311-100GRCT-ND
RT1 = TFPT1206L1002FM: Thermistor PTC 10K Ohm 1% 1206; Manufacturer: Vishay Dale; Designed by: Mustafa; Resistance: 10kR; Power Rating: 125mW; Voltage: 40V; Supplier 1: Digi-Key; Manufacturer Part Number: TFPT1206L1002FM; RoHS: Yes; Category: Thermistors; Stock 1: 9062; Pricing 1: 1=0,99000, 10=0,92300, 25=0,85400, 50=0,73980, 100=0,67110, 500=0,56432, 1000=0,50332 (USD); Mount: Surface Mount; Case/Package: 1206; Number of Pins: 2; Min Operating Temperature: -55°C; Max Operating Temperature: 125°C; Packaging: Tape and Reel; Package Quantity: 5000; Tolerance: 1%; Max Power Dissipation: 125mW; Termination: SMD/SMT; Series: TFPT; Resistance Tolerance: 1%; Length: 3.2mm; Width: 1.6mm; Height: 0.55mm; Depth: 1.6mm; Lead Free: Lead Free; RoHS Compliant: Yes; ComponentLink1URL: https://datasheet.ciiva.com/2852/tfpt-2852076.pdf?src-supplier=Digi-Key; ComponentLink1Description: https://datasheet.ciiva.com/2852/tfpt-2852076.pdf?src-supplier=Digi-Key; Supplier Part Number 1: 541-3533-1-ND
S1 = LHI 878/3902: SENSOR PYRO DETECTOR DUAL MOTION; Designed by: Mustafa; Max Supply Voltage: 12; Min Supply Voltage: 2; Type: Pyro detector; Supplier 1: Digi-Key; Supplier part number: 1601-LHI878/3902-ND; Case/Package: LHI 878
U8 = NCS36000: PIR Controller Low Noise Amplifiers and LDO Regulator 14-Pin SOIC N T/R; Manufacturer: ON Semiconductor; Designed by: Mustafa; Operating Supply Current: 50uA; Quiescent Current: 20uA; Min Supply Voltage: 3V; Max Supply Voltage: 5.75V; Output Type: Digital; Supplier 1: Digi-Key; Manufacturer Part Number: NCS36000DRG; RoHS: Yes; Category: Amplifiers - Op Amps, Buffer, Instrumentation; Stock 1: 36750; Pricing 1: 1=1,00000, 10=0,89400, 25=0,84880, 100=0,65180, 250=0,57600, 500=0,54568, 1000=0,42442 (USD); Case/Package: SOIC; Number of Pins: 14; Min Operating Temperature: -40°C; Max Operating Temperature: 85°C; Package Quantity: 1; Packaging: Tape and Reel; Series: -; Input Type: DIGITAL; Length: 8.75mm; Width: 4mm; Height: 1.5mm; Radiation Hardening: No; REACH SVHC: No SVHC; Lead Free: Lead Free; Halogen Free: Halogen Free; RoHS Compliant: Yes; ComponentLink1URL: https://datasheet.ciiva.com/1781/ncs36000-d-1781637.pdf?src-supplier=Digi-Key; ComponentLink1Description: https://datasheet.ciiva.com/1781/ncs36000-d-1781637.pdf?src-supplier=Digi-Key; ComponentLink2URL: https://datasheet.ciiva.com/4763/ncs36000-d-89569-4763639.pdf?src-supplier=Mouser; ComponentLink2Description: https://datasheet.ciiva.com/4763/ncs36000-d-89569-4763639.pdf?src-supplier=Mouser; ComponentLink3URL: https://datasheet.ciiva.com/1781/ncs36000-d-1781638.pdf?src-supplier=Digi-Key; ComponentLink3Description: https://datasheet.ciiva.com/1781/ncs36000-d-1781638.pdf?src-supplier=Digi-Key; ComponentLink4URL: https://datasheet.ciiva.com/1781/ncs36000-d-1781639.pdf?src-supplier=Digi-Key; ComponentLink4Description: https://datasheet.ciiva.com/1781/ncs36000-d-1781639.pdf?src-supplier=Digi-Key; ComponentLink5URL: https://datasheet.ciiva.com/26166/ncs36000-d-26166711.pdf?src-supplier=Avnet+Europe; ComponentLink5Description: https://datasheet.ciiva.com/26166/ncs36000-d-26166711.pdf?src-supplier=Avnet+Europe; ComponentLink6URL: https://datasheet.ciiva.com/2965/ncs36000-d-2965212.pdf?src-supplier=Avnet; ComponentLink6Description: https://datasheet.ciiva.com/2965/ncs36000-d-2965212.pdf?src-supplier=Avnet; ComponentLink7URL: https://datasheet.ciiva.com/2966/ncs36000-d-2966525.pdf?src-supplier=Avnet; ComponentLink7Description: https://datasheet.ciiva.com/2966/ncs36000-d-2966525.pdf?src-supplier=Avnet; Supplier Part Number 1: NCS36000DRGOSCT-ND
U9 = OPA314: Op Amp OPA314; Manufacturer: Texas Instruments; Designed by: BERK; Min Supply Voltage: 1.8V; Max Supply Voltage: 5.5V; Min Dual Supply Voltage: 900mV; Max Dual Supply Voltage: 2.75V; Voltage Gain: 128dB; Common Mode Rejection Ratio: 75dB; Gain Bandwidth Product: 3MHz; Output Current: 20mA; Nominal Supply Current: 150uA; Number of Channels: 1; Slew Rate: 1.5V/µs; Max I/O Voltage: 2.5mV; Input Bias Current: 10pA; Power Supply Rejection Ratio (PSRR): 78dB; Amplifier Type: GENERAL PURPOSE; Supplier 1: Digi-Key; Manufacturer Part Number: OPA314AIDBVR; RoHS: Yes; Category: Amplifiers - Op Amps, Buffer, Instrumentation; Stock 1: 964; Pricing 1: 1=1,06000, 10=0,95100, 25=0,90240, 100=0,69280, 250=0,61224, 500=0,58004, 1000=0,45114 (USD); Case/Package: SOT-23-5; Number of Pins: 5; Contact Plating: Gold; Min Operating Temperature: -40°C; Max Operating Temperature: 125°C; Package Quantity: 1; Packaging: Tape and Reel; Unity Gain Bandwidth Product: 3MHz; Nominal Gain Bandwidth Product: 3MHz; Input Offset Voltage (Vos): 2.5mV; Operating Supply Current: 150uA; Number of Circuits: 1; Output Current per Channel: 20mA; Number of Elements: 1; Supply Current: 150uA; Series: -; Technology: CMOS; Radiation Hardening: No; Lead Free: Lead Free; RoHS Compliant: Yes; ComponentLink1URL: https://datasheet.ciiva.com/14462/opa2314-14462006.pdf?src-supplier=Avnet; ComponentLink1Description: https://datasheet.ciiva.com/14462/opa2314-14462006.pdf?src-supplier=Avnet; ComponentLink2URL: https://datasheet.ciiva.com/26226/opa2314-26226295.pdf?src-supplier=Avnet+Europe; ComponentLink2Description: https://datasheet.ciiva.com/26226/opa2314-26226295.pdf?src-supplier=Avnet+Europe; ComponentLink3URL: https://datasheet.ciiva.com/14456/opa2314-14456281.pdf?src-supplier=Avnet; ComponentLink3Description: https://datasheet.ciiva.com/14456/opa2314-14456281.pdf?src-supplier=Avnet; ComponentLink4URL: https://datasheet.ciiva.com/29638/opa314-29638827.pdf?src-supplier=Digi-Key; ComponentLink4Description: https://datasheet.ciiva.com/29638/opa314-29638827.pdf?src-supplier=Digi-Key; Supplier Part Number 1: 296-36699-1-ND

## Nets that join several sheets
3V3DC: Microcontroller (26 pins), Power Management (8 pins)
5VDC: Microcontroller (BZ1.1 C32.2), Power Management (9 pins)
GND: Microcontroller (34 pins), Power Management (28 pins)
LED_DRIVER: Microcontroller (U3.21), Power Management (J7.3)
NetJ7_5: Microcontroller (U3.22), Power Management (J7.5)
NetR2_1: Microcontroller (U3.41), Power Management (R2.1)
NetR3_1: Microcontroller (U3.40), Power Management (R3.1)
SWCLK: Microcontroller (U3.37), Power Management (J6.3)
SWDIO: Microcontroller (U3.34), Power Management (J6.2)
TDI: Microcontroller (U3.38), Power Management (J6.4)
TEMPERATURE_ADC: Microcontroller (U3.19), Power Management (J7.4)
USB_N: Microcontroller (R6.2 U5.1 U5.6), Power Management (USB1.2)
USB_P: Microcontroller (R7.2 U5.3 U5.4), Power Management (USB1.3)

## Assembly variants
220V_Sebeke_Girisli: all parts fitted
12V_Adaptor_Girisli: not fitted BR1 C1 C2 D8 F1 J1 R1 T1